# Altium schematic sheet leds.SchDoc
size A3
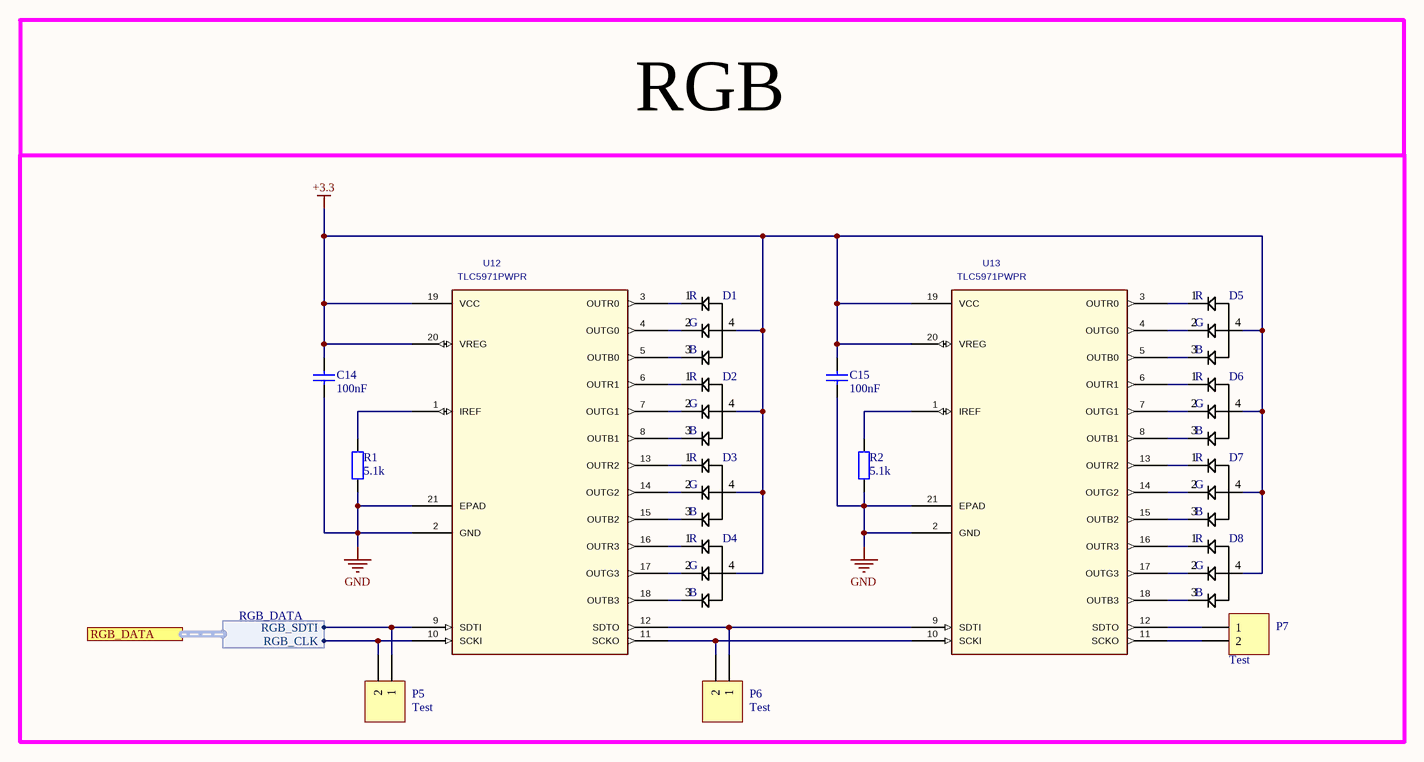
[diagram p0: leds.SchDoc]

## Parts
C14  100nF  [CAP_0402i_1005m -N]
C15  100nF  [CAP_0402i_1005m -N]
D1  67-23/R6GHBHC-B01/2T  [*PLCC-4]  (value not drawn)
D2  67-23/R6GHBHC-B01/2T  [*PLCC-4]  (value not drawn)
D3  67-23/R6GHBHC-B01/2T  [*PLCC-4]  (value not drawn)
D4  67-23/R6GHBHC-B01/2T  [*PLCC-4]  (value not drawn)
D5  67-23/R6GHBHC-B01/2T  [*PLCC-4]  (value not drawn)
D6  67-23/R6GHBHC-B01/2T  [*PLCC-4]  (value not drawn)
D7  67-23/R6GHBHC-B01/2T  [*PLCC-4]  (value not drawn)
D8  67-23/R6GHBHC-B01/2T  [*PLCC-4]  (value not drawn)
P5  Test  [HDR1X2]
P6  Test  [HDR1X2]
P7  Test  [HDR1X2]
R1  5.1k  [RES_0603i_1608m -N]
R2  5.1k  [RES_0603i_1608m -N]
U12  TLC5971PWPR  [PWP20_3P43X2P701]
U13  TLC5971PWPR  [PWP20_3P43X2P701]

## Ports
RGB_DATA (harness RGB_DATA)

## Harnesses
RGB_DATA: RGB_SDTI, RGB_CLK

## Nets
+3.3: C14.2 C15.2 D1.4(B14) D2.4(B14) D3.4(B14) D4.4(B14) D5.4(B14) D6.4(B14) D7.4(B14) D8.4(B14) U12.19(VCC) U12.20(VREG) U13.19(VCC) U13.20(VREG)
GND: C14.1 C15.1 R1.1 R2.1 U12.2(GND) U12.21(EPAD) U13.2(GND) U13.21(EPAD)
NetD1_1: D1.1(B15) U12.3(OUTR0)
NetD1_2: D1.2(B16) U12.4(OUTG0)
NetD1_3: D1.3(B17) U12.5(OUTB0)
NetD2_1: D2.1(B15) U12.6(OUTR1)
NetD2_2: D2.2(B16) U12.7(OUTG1)
NetD2_3: D2.3(B17) U12.8(OUTB1)
NetD3_1: D3.1(B15) U12.13(OUTR2)
NetD3_2: D3.2(B16) U12.14(OUTG2)
NetD3_3: D3.3(B17) U12.15(OUTB2)
NetD4_1: D4.1(B15) U12.16(OUTR3)
NetD4_2: D4.2(B16) U12.17(OUTG3)
NetD4_3: D4.3(B17) U12.18(OUTB3)
NetD5_1: D5.1(B15) U13.3(OUTR0)
NetD5_2: D5.2(B16) U13.4(OUTG0)
NetD5_3: D5.3(B17) U13.5(OUTB0)
NetD6_1: D6.1(B15) U13.6(OUTR1)
NetD6_2: D6.2(B16) U13.7(OUTG1)
NetD6_3: D6.3(B17) U13.8(OUTB1)
NetD7_1: D7.1(B15) U13.13(OUTR2)
NetD7_2: D7.2(B16) U13.14(OUTG2)
NetD7_3: D7.3(B17) U13.15(OUTB2)
NetD8_1: D8.1(B15) U13.16(OUTR3)
NetD8_2: D8.2(B16) U13.17(OUTG3)
NetD8_3: D8.3(B17) U13.18(OUTB3)
NetP5_1: P5.1 U12.9(SDTI) ; port RGB_DATA.RGB_SDTI
NetP5_2: P5.2 U12.10(SCKI) ; port RGB_DATA.RGB_CLK
NetP6_1: P6.1 U12.12(SDTO) U13.9(SDTI)
NetP6_2: P6.2 U12.11(SCKO) U13.10(SCKI)
NetP7_1: P7.1 U13.12(SDTO)
NetP7_2: P7.2 U13.11(SCKO)
NetR1_2: R1.2 U12.1(IREF)
NetR2_2: R2.2 U13.1(IREF)

## Notes on the sheet
- RGB
- 1
- 2
- 3
- 4
- 5
- 6
- 7
- 8
- A
- B
- C
- D
- Project:
- Date:
- Drawing number:
- Rev:
- Format:
- A3
- Drawn by:
- Laboratory:
- Page
- Sheet:
- of
- File:
- (in symbol 67-23/R6GHBHC-B01/2T) R; G; B

## Library data of the parts
C14 C15 = Cap: capacitor
P5-P7 = Header 2: Header, 2-Pin
R1 R2 = Res: Resistor
U12 U13 = TLC5971PWPR: C: Copyright (C) 2015 Accelerated Designs. All rights reserved; Vendor: Texas Instruments; Built_By: EMA_UL_Team; SourceLibrary: TI_2014-06-19; Value: TLC5971PWPR; Manufacturer_Part_Number: TLC5971PWPR; Manufacturer: Texas Instruments